# Altium schematic sheet ip_phone_e_wifi.SchDoc: WIFI
size A3; SheetNumber: 5; SheetTotal: 6
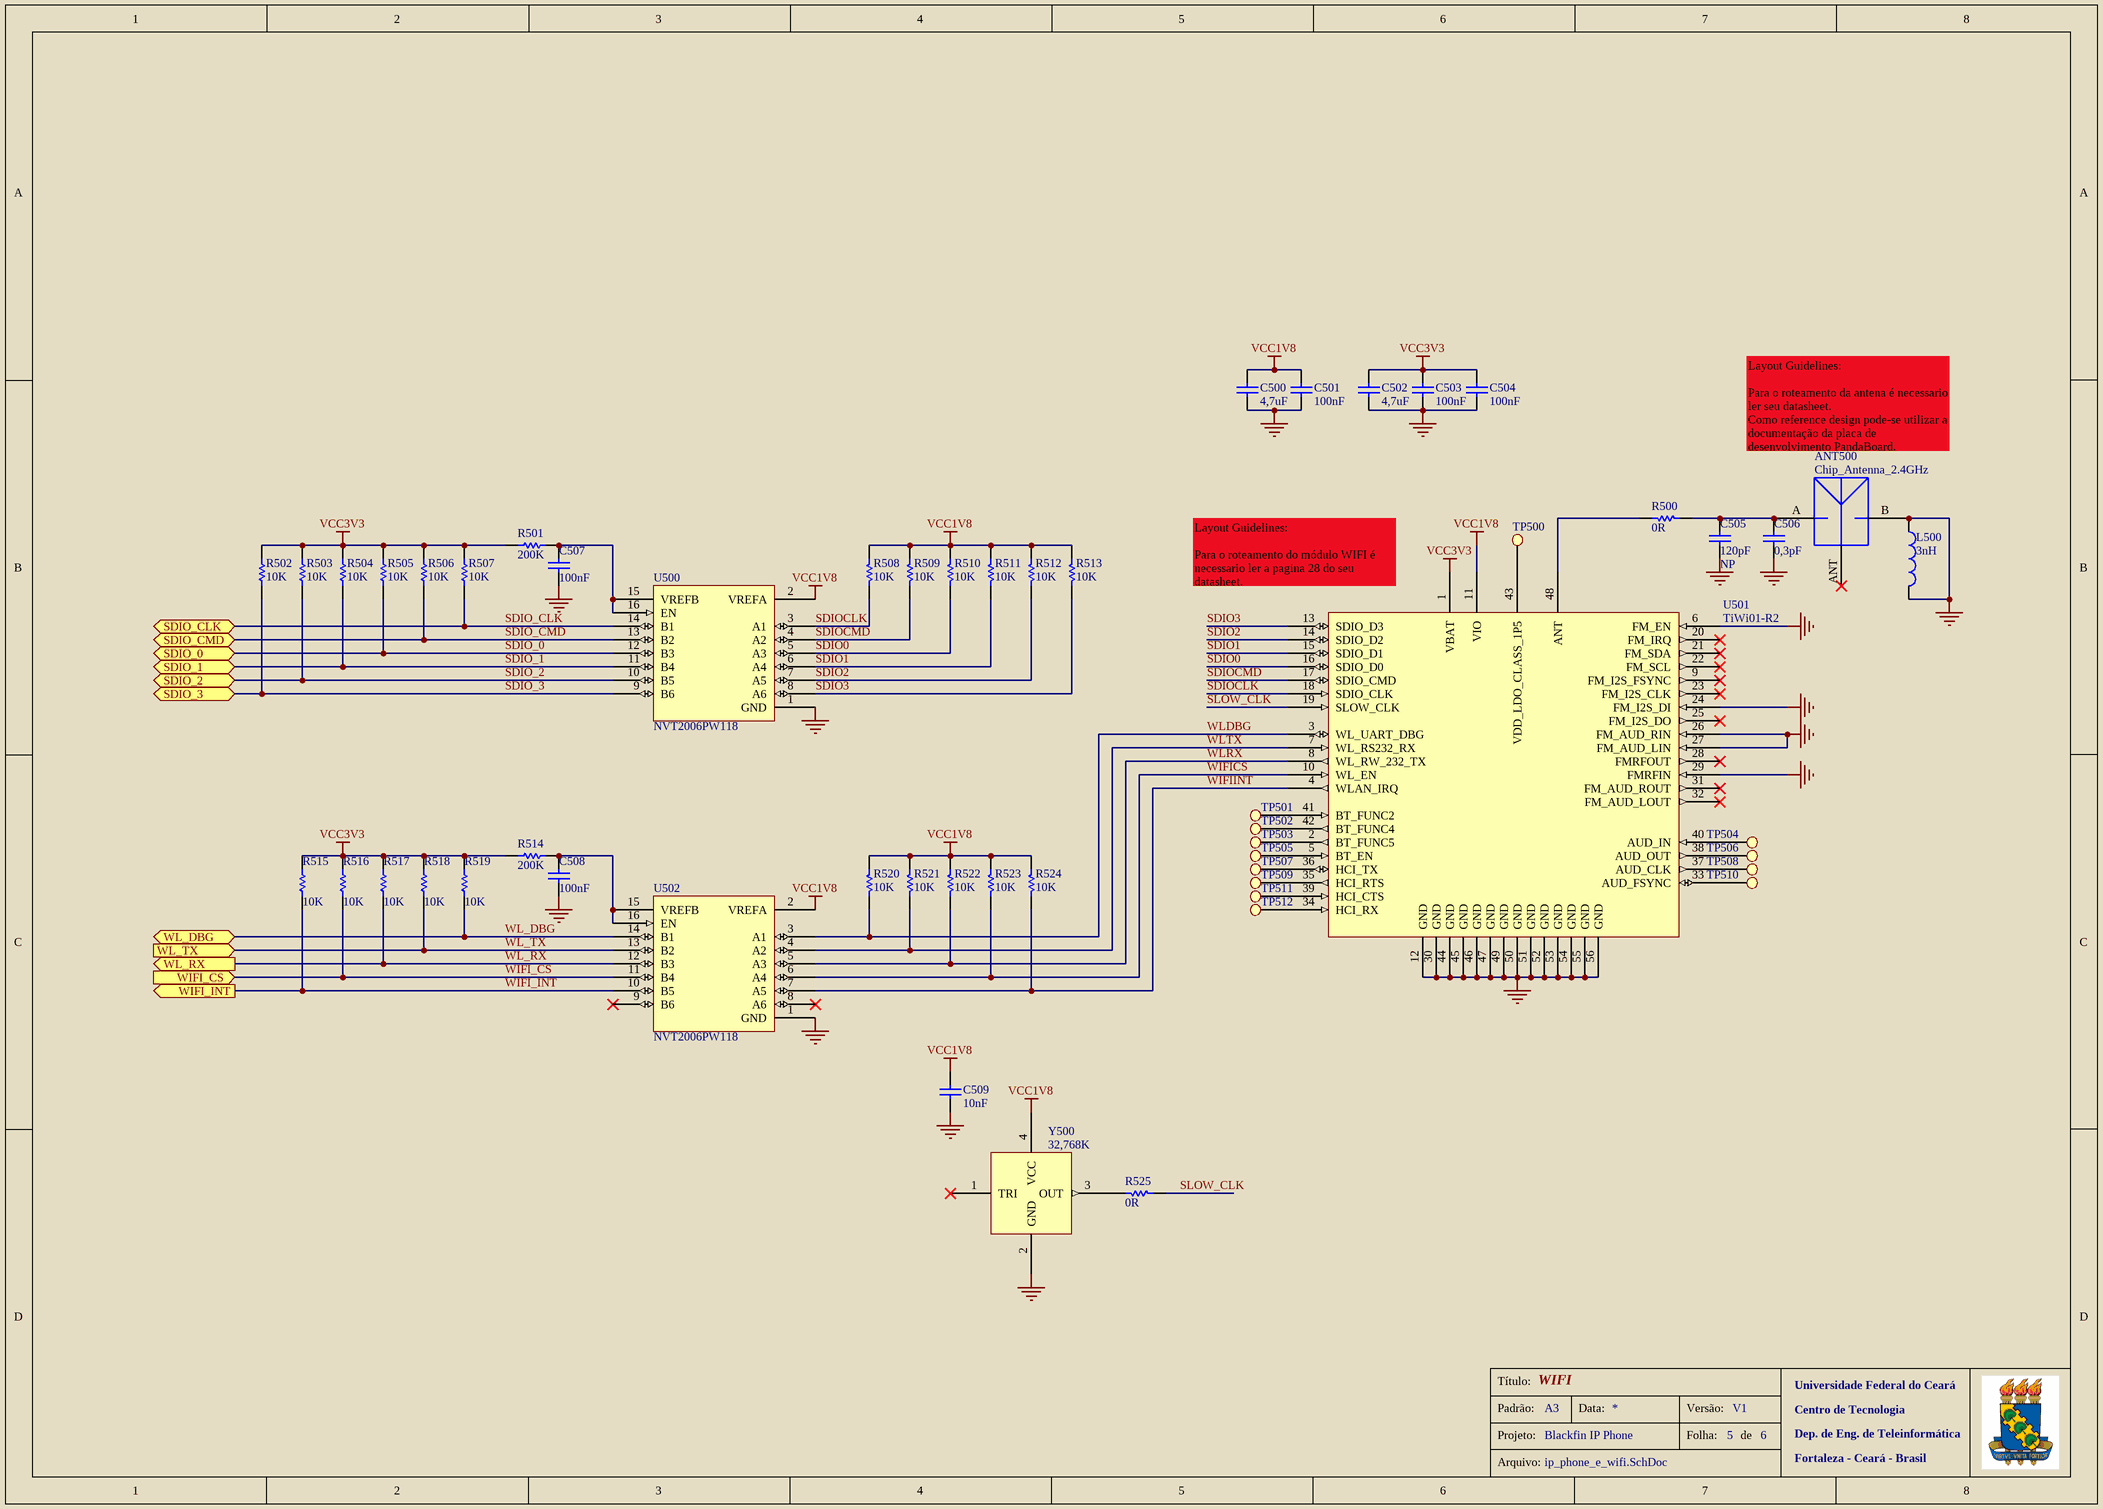
[diagram p0: ip_phone_e_wifi.SchDoc]

## Parts
ANT500  Chip_Antenna_2.4GHz  [ANTENNA]
C500  4,7uF  [CC1005-0402]
C501  100nF  [CC1005-0402]
C502  4,7uF  [CC1005-0402]
C503  100nF  [CC1005-0402]
C504  100nF  [CC1005-0402]
C505  120pF  [CC1005-0402_NP]
C506  0,3pF  [CC1005-0402]
C507  100nF  [CC1005-0402]
C508  100nF  [CC1005-0402]
C509  10nF  [CC1005-0402]
L500  3nH  [INDUTOR_0402]
R500  0R  [CR1005-0402]
R501  200K  [CR1005-0402]
R502  10K  [CR1005-0402]
R503  10K  [CR1005-0402]
R504  10K  [CR1005-0402]
R505  10K  [CR1005-0402]
R506  10K  [CR1005-0402]
R507  10K  [CR1005-0402]
R508  10K  [CR1005-0402]
R509  10K  [CR1005-0402]
R510  10K  [CR1005-0402]
R511  10K  [CR1005-0402]
R512  10K  [CR1005-0402]
R513  10K  [CR1005-0402]
R514  200K  [CR1005-0402]
R515  10K  [CR1005-0402]
R516  10K  [CR1005-0402]
R517  10K  [CR1005-0402]
R518  10K  [CR1005-0402]
R519  10K  [CR1005-0402]
R520  10K  [CR1005-0402]
R521  10K  [CR1005-0402]
R522  10K  [CR1005-0402]
R523  10K  [CR1005-0402]
R524  10K  [CR1005-0402]
R525  0R  [CR1005-0402]
TP500  Test Point  [Test Point]  (value not drawn)  (no BOM)
TP501  Test Point  [Test Point]  (value not drawn)  (no BOM)
TP502  Test Point  [Test Point]  (value not drawn)  (no BOM)
TP503  Test Point  [Test Point]  (value not drawn)  (no BOM)
TP504  Test Point  [Test Point]  (value not drawn)  (no BOM)
TP505  Test Point  [Test Point]  (value not drawn)  (no BOM)
TP506  Test Point  [Test Point]  (value not drawn)  (no BOM)
TP507  Test Point  [Test Point]  (value not drawn)  (no BOM)
TP508  Test Point  [Test Point]  (value not drawn)  (no BOM)
TP509  Test Point  [Test Point]  (value not drawn)  (no BOM)
TP510  Test Point  [Test Point]  (value not drawn)  (no BOM)
TP511  Test Point  [Test Point]  (value not drawn)  (no BOM)
TP512  Test Point  [Test Point]  (value not drawn)  (no BOM)
U500  NVT2006PW118  [TSSOP16]
U501  TiWi01-R2  [WIFI_MODULE]
U502  NVT2006PW118  [TSSOP16]
Y500  32,768K  [OSCILLATOR_32K]

## Ports
SDIO_0 (bidir), SDIO_1 (bidir), SDIO_2 (bidir), SDIO_3 (bidir), SDIO_CLK (bidir), SDIO_CMD (bidir), WIFI_CS (in), WIFI_INT (out), WL_DBG (bidir), WL_RX (out), WL_TX (in)

## Nets
GND: ANT500.B(FIXINGELEC) C500.2 C501.2 C502.2 C503.2 C504.2 C505.1 C506.1 C507.1 C508.1 C509.1 L500.1 L500.2 U500.1(GND) U501.6(FM_EN) U501.12(GND) U501.24(FM_I2S_DI) U501.26(FM_AUD_RIN) U501.27(FM_AUD_LIN) U501.29(FMRFIN) U501.30(GND) U501.44(GND) U501.45(GND) U501.46(GND) U501.47(GND) U501.49(GND) U501.50(GND) U501.51(GND) U501.52(GND) U501.53(GND) U501.54(GND) U501.55(GND) U501.56(GND) U502.1(GND) Y500.2(GND)
VCC1V8: C500.1 C501.1 C509.2 R508.2 R509.2 R510.2 R511.2 R512.2 R513.2 R520.2 R521.2 R522.2 R523.2 R524.2 U500.2(VREFA) U501.11(VIO) U502.2(VREFA) Y500.4(VCC)
VCC3V3: C502.1 C503.1 C504.1 R501.2 R502.1 R503.1 R504.1 R505.1 R506.1 R507.1 R514.2 R515.2 R516.2 R517.2 R518.2 R519.2 U501.1(VBAT)
SDIO0: R510.1 U500.5(A3) U501.16(SDIO_D0)
SDIO1: R511.1 U500.6(A4) U501.15(SDIO_D1)
SDIO2: R512.1 U500.7(A5) U501.14(SDIO_D2)
SDIO3: R513.1 U500.8(A6) U501.13(SDIO_D3)
SDIO_0: R505.2 U500.12(B3) ; port SDIO_0
SDIO_1: R504.2 U500.11(B4) ; port SDIO_1
SDIO_2: R503.2 U500.10(B5) ; port SDIO_2
SDIO_3: R502.2 U500.9(B6) ; port SDIO_3
SDIO_CLK: R507.2 U500.14(B1) ; port SDIO_CLK
SDIO_CMD: R506.2 U500.13(B2) ; port SDIO_CMD
SDIOCLK: R508.1 U500.3(A1) U501.18(SDIO_CLK)
SDIOCMD: R509.1 U500.4(A2) U501.17(SDIO_CMD)
SLOW_CLK: R525.1 U501.19(SLOW_CLK)
WIFI_CS: R516.1 U502.11(B4) ; port WIFI_CS
WIFI_INT: R515.1 U502.10(B5) ; port WIFI_INT
WIFICS: R523.1 U501.10(WL_EN) U502.6(A4)
WIFIINT: R524.1 U501.4(WLAN_IRQ) U502.7(A5)
WL_DBG: R519.1 U502.14(B1) ; port WL_DBG
WL_RX: R517.1 U502.12(B3) ; port WL_RX
WL_TX: R518.1 U502.13(B2) ; port WL_TX
WLDBG: R520.1 U501.3(WL_UART_DBG) U502.3(A1)
WLRX: R522.1 U501.8(WL_RW_232_TX) U502.5(A3)
WLTX: R521.1 U501.7(WL_RS232_RX) U502.4(A2)
NetANT500_A: ANT500.A(FEEDPOINT) C505.2 C506.2 R500.1
NetC507_2: C507.2 R501.1 U500.15(VREFB) U500.16(EN)
NetC508_2: C508.2 R514.1 U502.15(VREFB) U502.16(EN)
NetR500_2: R500.2 U501.48(ANT)
NetR525_2: R525.2 Y500.3(OUT)
NetTP500_1: TP500.1 U501.43(VDD_LDO_CLASS_1P5)
NetTP501_1: TP501.1 U501.41(BT_FUNC2)
NetTP502_1: TP502.1 U501.42(BT_FUNC4)
NetTP503_1: TP503.1 U501.2(BT_FUNC5)
NetTP504_1: TP504.1 U501.40(AUD_IN)
NetTP505_1: TP505.1 U501.5(BT_EN)
NetTP506_1: TP506.1 U501.38(AUD_OUT)
NetTP507_1: TP507.1 U501.36(HCI_TX)
NetTP508_1: TP508.1 U501.37(AUD_CLK)
NetTP509_1: TP509.1 U501.35(HCI_RTS)
NetTP510_1: TP510.1 U501.33(AUD_FSYNC)
NetTP511_1: TP511.1 U501.39(HCI_CTS)
NetTP512_1: TP512.1 U501.34(HCI_RX)

Not connected (* = marked no-connect by the designer): ANT500 ANT(ANTENNA)*; U501 9(FM_I2S_FSYNC)* 20(FM_IRQ)* 21(FM_SDA)* 22(FM_SCL)* 23(FM_I2S_CLK)* 25(FM_I2S_DO)* 28(FMRFOUT)* 31(FM_AUD_ROUT)* 32(FM_AUD_LOUT)*; U502 8(A6)* 9(B6)*; Y500 1(TRI)*

## Notes on the sheet
- Layout Guidelines:
  Para o roteamento da antena é necessario ler seu datasheet.
  Como reference design pode-se utilizar a documentação da placa de desenvolvimento PandaBoard.
- (near U501) Layout Guidelines:
  Para o roteamento do módulo WIFI é necessario ler a pagina 28 do seu datasheet.
- Título:
- Universidade Federal do Ceará
- Padrão:
- Projeto:
- A3
- Blackfin IP Phone
- Data:
- Versão:
- Folha:
- V1
- de
- Centro de Tecnologia
- Dep. de Eng. de Teleinformática
- Fortaleza - Ceará - Brasil
- Arquivo:

## Library data of the parts
ANT500 = Antenna2_4GHzChip: Antenna 2.4GHz Ceramic Chip SMD; Manufacturer: TDK; eVendorPart#: 445-6134-1-ND; Part#: ANT040015CCS2442MA1; eVendorPrice: 5,94; eVendor: Digikey; MSRP: 3,15; MOQ: 1000
C500 C502 = Capacitor: MLCC - SMD/SMT 4.7uF 20% 6.3Volts 0402; eVendorPart#: 810-C1005X5R0J475M; Manufacturer: TDK; Part#: C1005X5R0J475MT; eVendor: Mouser; eVendorPrice: 0,22; MSRP: 0,108; MOQ: 1000
C501 C503 C504 C507 C508 = Capacitor: MLCC - SMD/SMT 0.1UF 16V 10% 0402; eVendorPart#: 810-C1005X7R1C104K; Manufacturer: TDK; Part#: C1005X7R1C104KT; eVendor: Mouser; eVendorPrice: 0,03; MSRP: 0,005; MOQ: 1000
C505 = Capacitor: MLCC - SMD/SMT 0402 120pF 50volts C0G 5%; eVendorPart#: 810-C1005C0G1H121J; Manufacturer: TDK; Part#: C1005C0G1H121JT; eVendor: Mouser; eVendorPrice: 0,03; MSRP: 0,007; MOQ: 1000; NP: NP
C506 = Capacitor: MLCC - SMD/SMT 0.3pF 50Volts C0G 0.1pF; eVendorPart#: 81-GRM1535C1HR30BD5D; Manufacturer: Murata; Part#: GRM1535C1HR30BDD5D; eVendor: Mouser; eVendorPrice: 0,15; MSRP: 0,012; MOQ: 1000
C509 = Capacitor: Ceramic Capacitor 10nF 50V X7R 0402; eVendorPart#: 810-C1005X7R1C103K; Manufacturer: TDK; Part#: C1005X7R1C103KT; eVendor: Mouser; eVendorPrice: 0,03; MSRP: 0,004; MOQ: 1000
L500 = Inductor: eVendorPart#: 712-1457-1-ND; Manufacturer: Johanson Technology Inc; Part#: L-07C3N0SV6T; eVendor: Digikey; eVendorPrice: 0,04; MSRP: 0,225; MOQ: 1000
R500 R525 = Resistor: Thick Film Resistors 0402 1/16W Jumper; eVendorPart#: 667-ERJ-2GE0R00X; Manufacturer: Panasonic Electronic Components; Part#: ERJ-2GE0R00X; eVendor: Mouser; eVendorPrice: 0,05; MSRP: 0,004; MOQ: 1000
R501 R514 = Resistor: Thick Film Resistors 1/16WATT 200K 0402; eVendorPart#: 304-200K-RC; Manufacturer: Xicon; eVendor: Mouser; eVendorPrice: 0,04; MSRP: 0,016; MOQ: 1000; Part#: 304-200K-RC
R502-R513 R515-R524 = Resistor: Thick Film Resistors SMD 0402 10K 5%  1/16 W; eVendorPart#: 311-10KJRCT-ND; Manufacturer: Yageo; Part#: RC0402JR-0710KL; eVendor: Digikey; eVendorPrice: 0,012; MSRP: 0,00253; MOQ: 1000
TP500-TP512 = Test Point: eVendor: NÃO SE APLICA; eVendorPrice: 0,00; eVendorPart#: NÃO SE APLICA; Part#: NÃO SE APLICA; Manufacturer: NÃO SE APLICA; MOQ: 1000; MSRP: 0,00
U500 U502 = NVT2006PW118: Translation - Voltage Levels +/-50mA 1.5ns 2.1-5V; eVendorPart#: 771-NVT2006PW118; Manufacturer: NXP Semiconductors; Part#: NVT2006PW,118; eVendor: Mouser; eVendorPrice: 0,76; MSRP: 0,375; MOQ: 1000
U501 = TiWi01-R2: WiFi / 802.11 TiWi01-R2 Module with U.FL Connector; eVendorPart#: 741-450-0037; Manufacturer: LS Research; Part#: 450-0037; eVendor: Mouser; eVendorPrice: 32,55; MSRP: 30,80; MOQ: 100
Y500 = Oscillator_32K: Standard Clock Oscillators 32.768KHz 1.8V -40C +85C 25ppm; eVendorPart#: 815-ASEK2-32.7K-LRT; Manufacturer: Abracon; Part#: ASEK2-32.768KHz-LRT; eVendor: Mouser; eVendorPrice: 3,66; MSRP: 2,44; MOQ: 500